# EAGLE schematic sensor (EAGLE 9.4.2)

## Sheet 1 of 2
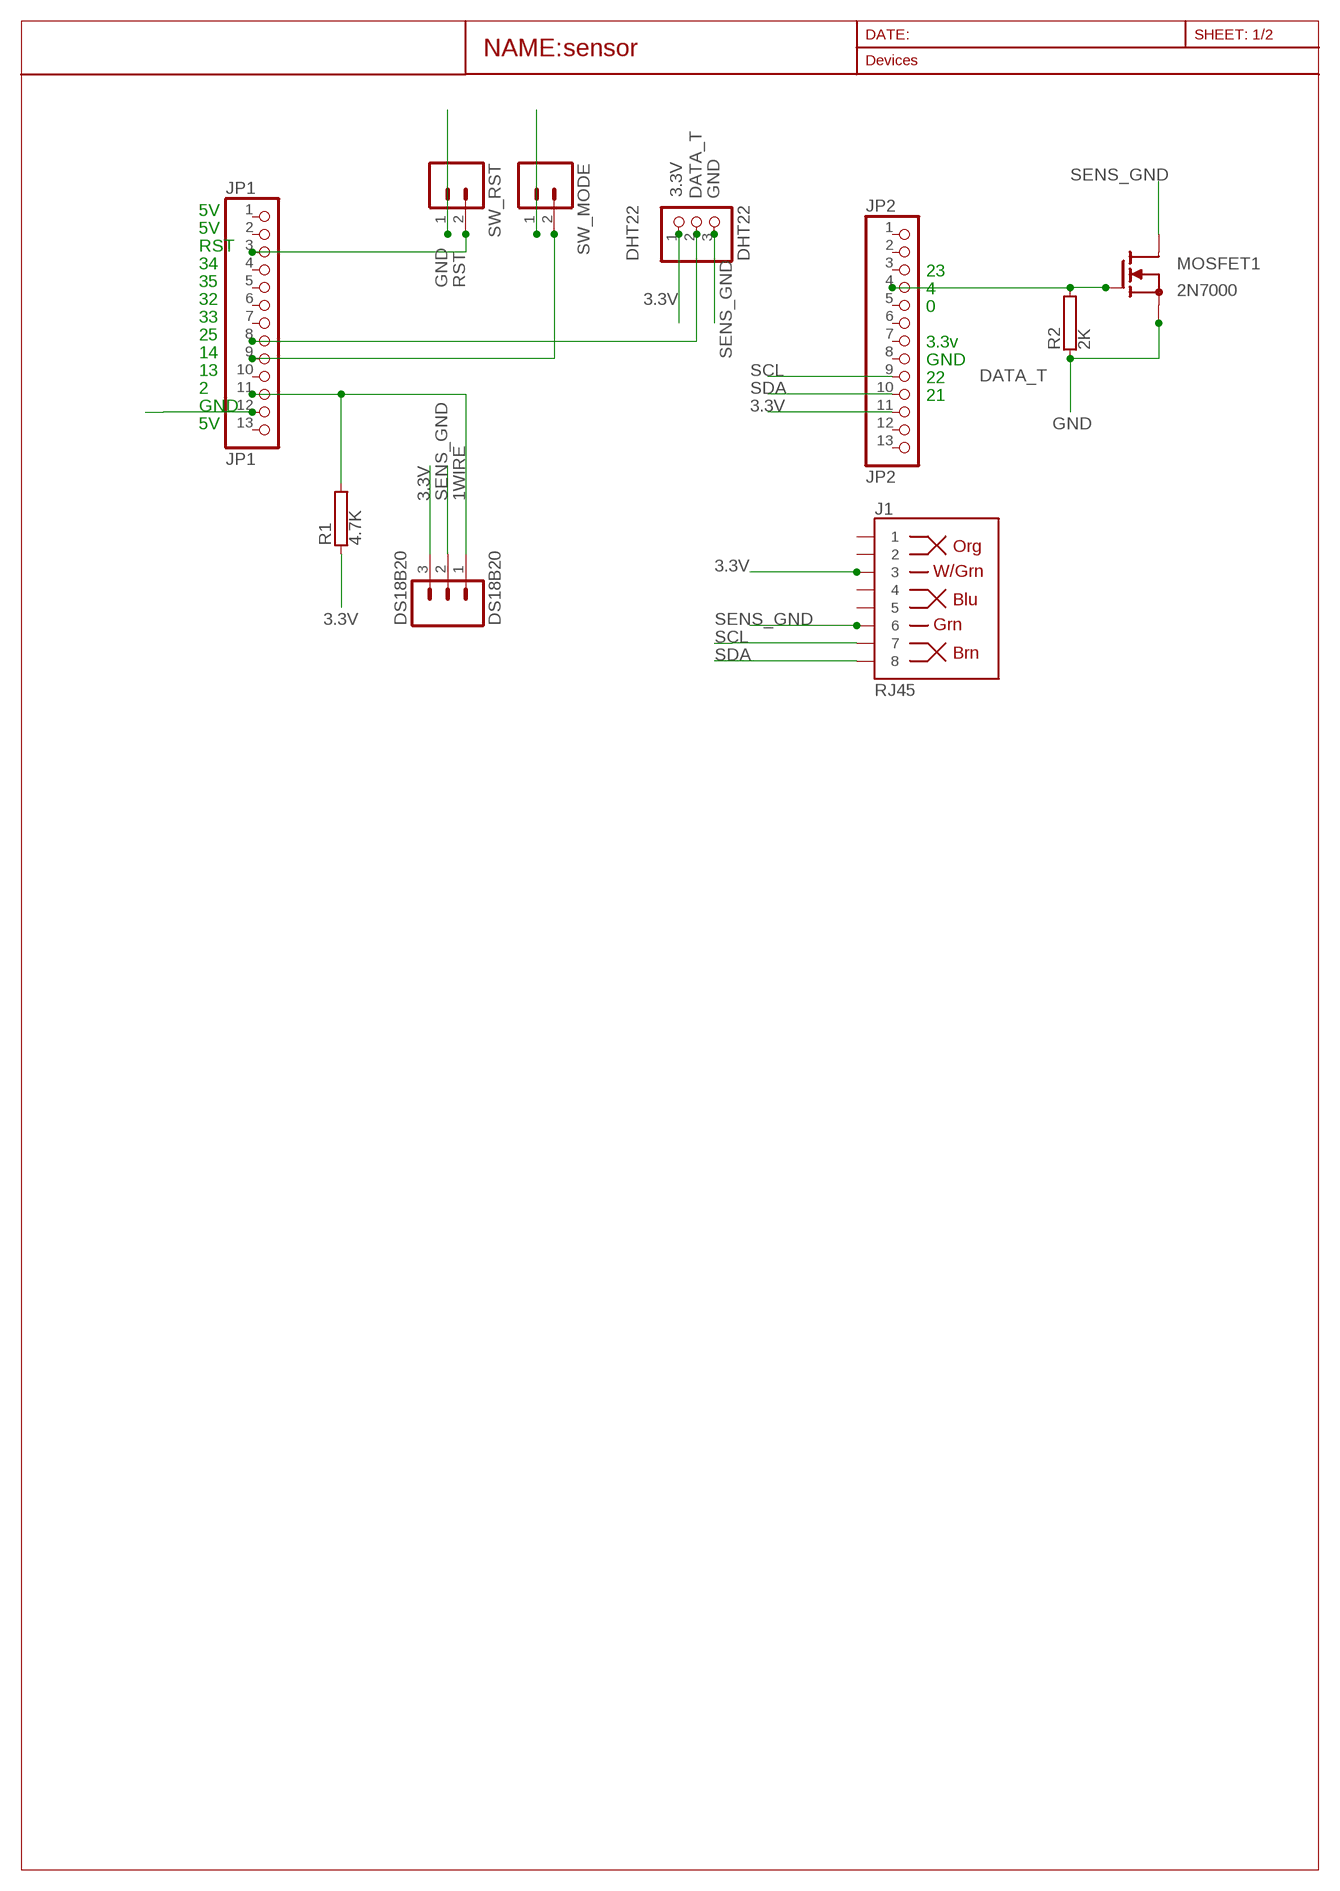
[diagram p0: schematic, sheet 1]

### Parts
DHT22  DHT22  PINHD-1X3  [1X03]
DS18B20  DS18B20  M03  [03P]
J1  RJ45  RJ45-8  [RJ45-8]
JP1  JP1  PINHD-1X13  [1X13]
JP2  JP2  PINHD-1X13  [1X13]
MOSFET1  2N7000  [TO92]
R1  4.7K  RHPS58  [HPS58]
R2  2K  RHPS58  [HPS58]
SW_MODE  SW1  M02  [02P]
SW_RST  SW2  M02  [02P]

### Nets
1WIRE: DS18B20.1 JP1.11 R1.2
3.3V: DHT22.1 DS18B20.3 J1.3 JP2.11 R1.1
DATA_T: DHT22.2 JP1.8
GND: JP1.12 MOSFET1.C(S) R2.1 SW_MODE.1 SW_RST.1
MODE: JP1.9 SW_MODE.2
N$7: JP2.4 MOSFET1.B(G) R2.2
RST: JP1.3 SW_RST.2
SCL: J1.7 JP2.9
SDA: J1.8 JP2.10
SENS_GND: DHT22.3 DS18B20.2 J1.6 MOSFET1.E(D)
Unconnected: J1.1 J1.2 J1.4 J1.5 JP1.1 JP1.2 JP1.4 JP1.5 JP1.6 JP1.7 JP1.10 JP1.13 JP2.1 JP2.2 JP2.3 JP2.5 JP2.6 JP2.7 JP2.8 JP2.12 JP2.13

### Notes on the sheet
- 5V
- 5V
- RST
- 34
- 23
- 35
- 4
- 32
- 0
- 33
- 25
- 3.3v
- 14
- GND
- 13
- 22
- 2
- 21
- GND
- 5V

## Sheet 2 of 2

## Library data of the parts
DHT22 = adafruit:PINHD-1X3: PIN HEADER
DS18B20 = con-amp-quick:M03: AMP QUICK CONNECTOR; OC_FARNELL: unknown; OC_NEWARK: unknown
J1 = SparkFun-Connectors:RJ45-8: RJ45 Jack - 8 pin Simple RJ45, 8-pin connection. Commonly used for Cat5, Cat5e, and Cat6 Ethernet cables. Here is the connector we sell at SparkFun: RJ45 8-Pin Connector <https://www.sparkfun.com/products/643> (PRT-00643) Datasheet <https://cdn.sparkfun.com/datasheets/Prototyping/04908.pdf> It is used on this SparkFun product: SparkFun RJ45 Breakout <https://www.sparkfun.com/products/716> (BOB-00716) Note, you may also be interested in the "MAGJACK" version of this. It is basically a RJ45 connector, but also has some status LEDs built into the connector housing. You can check that out in this library at the device named "MAGJACK.dev" and see these products online: RJ45 Ethernet MagJack-Compatible <https://www.sparkfun.com/products/8534> (PRT-08534) SparkFun RJ45 MagJack Breakout <https://www.sparkfun.com/products/13021> (BOB-13021); PROD_ID: CONN-08506; SF_ID: PRT-00643
JP1 JP2 = adafruit:PINHD-1X13: PIN HEADER
MOSFET1 = 2N7000:2N7000; AVAILABILITY: Unavailable; DESCRIPTION: MOSFETs- Power and Small Signal 60V 200mA N-Channel No-Cancel/No-Return; MF: STMicroelectronics; MP: 2N7000; PACKAGE: TO-92 ON Semiconductor; PRICE: None
R1 R2 = resistor-power:R: Power Resitor; OC_FARNELL: unknown; OC_NEWARK: unknown
SW_MODE SW_RST = con-amp-quick:M02: AMP QUICK CONNECTOR; OC_FARNELL: unknown; OC_NEWARK: unknown

## Module SWITCHES
Ports: 

### Library data of the parts

## Module POWER
Ports: VCC(io) 3.3V(io) GND(io) ENABLE(io)

### Library data of the parts